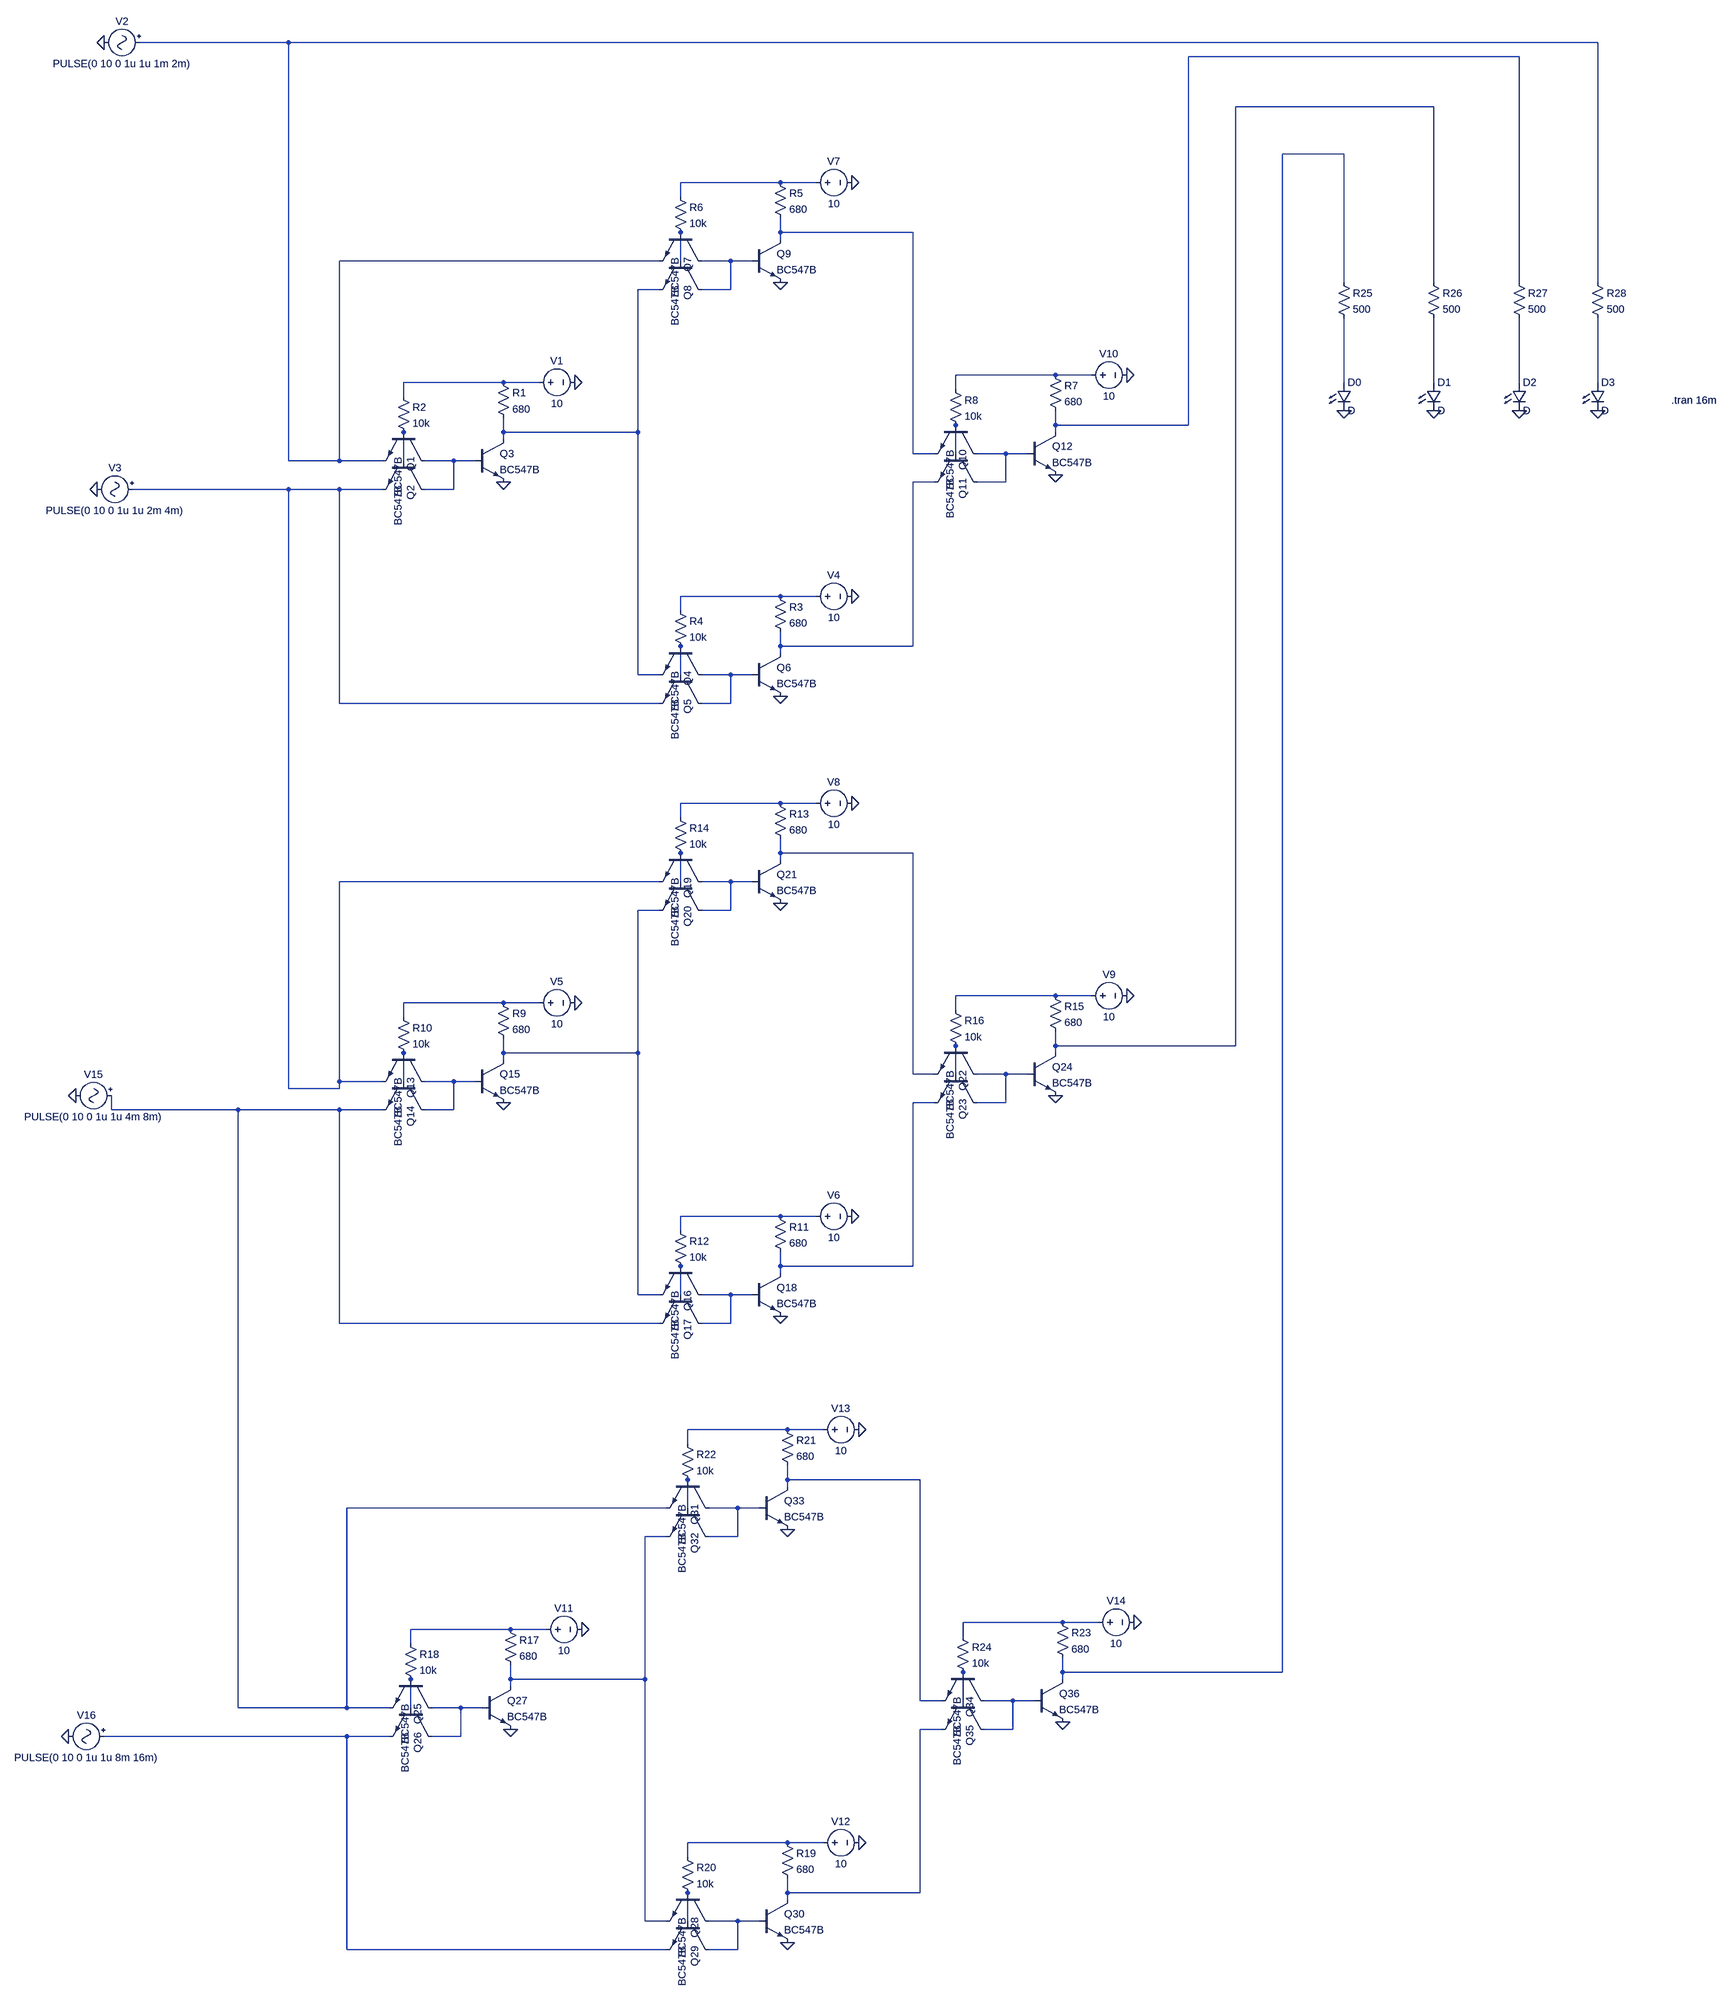
[diagram p0: schematic Draft1.asc]
Draft1.asc, the LTspice schematic file:
Version 4.1
SHEET 1 4320 3700
WIRE -544 -816 -2016 -816
WIRE 4000 -816 -544 -816
WIRE 3824 -784 1968 -784
WIRE 3632 -672 2144 -672
WIRE 3424 -544 2352 -544
WIRE 992 -480 768 -480
WIRE 1072 -480 992 -480
WIRE 768 -448 768 -480
WIRE 992 -368 992 -400
WIRE 1328 -368 992 -368
WIRE 992 -352 992 -368
WIRE 720 -304 -96 -304
WIRE 768 -304 768 -368
WIRE 880 -304 816 -304
WIRE 928 -304 880 -304
WIRE 3424 -256 3424 -544
WIRE 3632 -256 3632 -672
WIRE 3824 -256 3824 -784
WIRE 4000 -256 4000 -816
WIRE 720 -240 672 -240
WIRE 880 -240 880 -304
WIRE 880 -240 816 -240
WIRE 1648 -48 1424 -48
WIRE 1728 -48 1648 -48
WIRE 272 -32 48 -32
WIRE 352 -32 272 -32
WIRE 3424 -32 3424 -176
WIRE 3632 -32 3632 -176
WIRE 3824 -32 3824 -176
WIRE 4000 -32 4000 -176
WIRE 1424 -16 1424 -48
WIRE 48 0 48 -32
WIRE 1648 64 1648 32
WIRE 1968 64 1968 -784
WIRE 1968 64 1648 64
WIRE 272 80 272 48
WIRE 672 80 672 -240
WIRE 672 80 272 80
WIRE 1648 80 1648 64
WIRE 272 96 272 80
WIRE 1328 128 1328 -368
WIRE 1376 128 1328 128
WIRE 1424 128 1424 64
WIRE 1536 128 1472 128
WIRE 1584 128 1536 128
WIRE -544 144 -544 -816
WIRE -96 144 -96 -304
WIRE -96 144 -544 144
WIRE 0 144 -96 144
WIRE 48 144 48 80
WIRE 160 144 96 144
WIRE 208 144 160 144
WIRE 1376 192 1328 192
WIRE 1536 192 1536 128
WIRE 1536 192 1472 192
WIRE -544 208 -2032 208
WIRE -96 208 -544 208
WIRE 0 208 -96 208
WIRE 160 208 160 144
WIRE 160 208 96 208
WIRE 992 480 768 480
WIRE 1072 480 992 480
WIRE 768 512 768 480
WIRE 992 592 992 560
WIRE 1328 592 1328 192
WIRE 1328 592 992 592
WIRE 992 608 992 592
WIRE 672 656 672 80
WIRE 720 656 672 656
WIRE 768 656 768 592
WIRE 880 656 816 656
WIRE 928 656 880 656
WIRE -96 720 -96 208
WIRE 720 720 -96 720
WIRE 880 720 880 656
WIRE 880 720 816 720
WIRE 992 944 768 944
WIRE 1072 944 992 944
WIRE 768 976 768 944
WIRE 992 1056 992 1024
WIRE 1328 1056 992 1056
WIRE 992 1072 992 1056
WIRE 720 1120 -96 1120
WIRE 768 1120 768 1056
WIRE 880 1120 816 1120
WIRE 928 1120 880 1120
WIRE 720 1184 672 1184
WIRE 880 1184 880 1120
WIRE 880 1184 816 1184
WIRE 1648 1376 1424 1376
WIRE 1728 1376 1648 1376
WIRE 272 1392 48 1392
WIRE 352 1392 272 1392
WIRE 1424 1408 1424 1376
WIRE 48 1424 48 1392
WIRE 1648 1488 1648 1456
WIRE 2144 1488 2144 -672
WIRE 2144 1488 1648 1488
WIRE 272 1504 272 1472
WIRE 672 1504 672 1184
WIRE 672 1504 272 1504
WIRE 1648 1504 1648 1488
WIRE 272 1520 272 1504
WIRE 1328 1552 1328 1056
WIRE 1376 1552 1328 1552
WIRE 1424 1552 1424 1488
WIRE 1536 1552 1472 1552
WIRE 1584 1552 1536 1552
WIRE -96 1568 -96 1120
WIRE 0 1568 -96 1568
WIRE 48 1568 48 1504
WIRE 160 1568 96 1568
WIRE 208 1568 160 1568
WIRE -544 1584 -544 208
WIRE -96 1584 -96 1568
WIRE -96 1584 -544 1584
WIRE 1376 1616 1328 1616
WIRE 1536 1616 1536 1552
WIRE 1536 1616 1472 1616
WIRE -2080 1632 -2080 1600
WIRE -704 1632 -2080 1632
WIRE -96 1632 -704 1632
WIRE 0 1632 -96 1632
WIRE 160 1632 160 1568
WIRE 160 1632 96 1632
WIRE 992 1904 768 1904
WIRE 1072 1904 992 1904
WIRE 768 1936 768 1904
WIRE 992 2016 992 1984
WIRE 1328 2016 1328 1616
WIRE 1328 2016 992 2016
WIRE 992 2032 992 2016
WIRE 672 2080 672 1504
WIRE 720 2080 672 2080
WIRE 768 2080 768 2016
WIRE 880 2080 816 2080
WIRE 928 2080 880 2080
WIRE -96 2144 -96 1632
WIRE 720 2144 -96 2144
WIRE 880 2144 880 2080
WIRE 880 2144 816 2144
WIRE 1008 2416 784 2416
WIRE 1088 2416 1008 2416
WIRE 784 2448 784 2416
WIRE 1008 2528 1008 2496
WIRE 1344 2528 1008 2528
WIRE 1008 2544 1008 2528
WIRE 736 2592 -80 2592
WIRE 784 2592 784 2528
WIRE 896 2592 832 2592
WIRE 944 2592 896 2592
WIRE 736 2656 688 2656
WIRE 896 2656 896 2592
WIRE 896 2656 832 2656
WIRE 1664 2848 1440 2848
WIRE 1744 2848 1664 2848
WIRE 288 2864 64 2864
WIRE 368 2864 288 2864
WIRE 1440 2880 1440 2848
WIRE 64 2896 64 2864
WIRE 1664 2960 1664 2928
WIRE 2352 2960 2352 -544
WIRE 2352 2960 1664 2960
WIRE 288 2976 288 2944
WIRE 688 2976 688 2656
WIRE 688 2976 288 2976
WIRE 1664 2976 1664 2960
WIRE 288 2992 288 2976
WIRE 1344 3024 1344 2528
WIRE 1392 3024 1344 3024
WIRE 1440 3024 1440 2960
WIRE 1552 3024 1488 3024
WIRE 1600 3024 1552 3024
WIRE -704 3040 -704 1632
WIRE -80 3040 -80 2592
WIRE -80 3040 -704 3040
WIRE 16 3040 -80 3040
WIRE 64 3040 64 2976
WIRE 176 3040 112 3040
WIRE 224 3040 176 3040
WIRE 1392 3088 1344 3088
WIRE 1552 3088 1552 3024
WIRE 1552 3088 1488 3088
WIRE -80 3104 -2096 3104
WIRE 16 3104 -80 3104
WIRE 176 3104 176 3040
WIRE 176 3104 112 3104
WIRE 1008 3376 784 3376
WIRE 1088 3376 1008 3376
WIRE 784 3408 784 3376
WIRE 1008 3488 1008 3456
WIRE 1344 3488 1344 3088
WIRE 1344 3488 1008 3488
WIRE 1008 3504 1008 3488
WIRE 688 3552 688 2976
WIRE 736 3552 688 3552
WIRE 784 3552 784 3488
WIRE 896 3552 832 3552
WIRE 944 3552 896 3552
WIRE -80 3616 -80 3104
WIRE 736 3616 -80 3616
WIRE 896 3616 896 3552
WIRE 896 3616 832 3616
FLAG 272 192 0
FLAG 432 -32 0
FLAG 992 704 0
FLAG 1152 480 0
FLAG 992 -256 0
FLAG 1152 -480 0
FLAG 1648 176 0
FLAG 1808 -48 0
FLAG 272 1616 0
FLAG 432 1392 0
FLAG 992 2128 0
FLAG 1152 1904 0
FLAG 992 1168 0
FLAG 1152 944 0
FLAG 1648 1600 0
FLAG 1808 1376 0
FLAG 288 3088 0
FLAG 448 2864 0
FLAG 1008 3600 0
FLAG 1168 3376 0
FLAG 1008 2640 0
FLAG 1168 2416 0
FLAG 1664 3072 0
FLAG 1824 2848 0
FLAG -2096 -816 0
FLAG -2160 1600 0
FLAG -2176 3104 0
FLAG 4000 32 0
FLAG 3824 32 0
FLAG 3632 32 0
FLAG 3424 32 0
FLAG -2112 208 0
SYMBOL npn 96 80 R90
WINDOW 3 56 60 Left 2
SYMATTR InstName Q1
SYMATTR Value BC547B
SYMBOL npn 96 144 R90
WINDOW 3 56 60 Left 2
SYMATTR InstName Q2
SYMATTR Value BC547B
SYMBOL npn 208 96 R0
SYMATTR InstName Q3
SYMATTR Value BC547B
SYMBOL res 256 -48 R0
SYMATTR InstName R1
SYMATTR Value 680
SYMBOL res 32 -16 R0
SYMATTR InstName R2
SYMATTR Value 10k
SYMBOL voltage 336 -32 R270
WINDOW 0 32 56 VTop 2
WINDOW 3 -32 56 VBottom 2
WINDOW 123 0 0 Left 0
WINDOW 39 0 0 Left 0
SYMATTR InstName V1
SYMATTR Value 10
SYMBOL npn 816 592 R90
WINDOW 3 56 60 Left 2
SYMATTR InstName Q4
SYMATTR Value BC547B
SYMBOL npn 816 656 R90
WINDOW 3 56 60 Left 2
SYMATTR InstName Q5
SYMATTR Value BC547B
SYMBOL npn 928 608 R0
SYMATTR InstName Q6
SYMATTR Value BC547B
SYMBOL res 976 464 R0
SYMATTR InstName R3
SYMATTR Value 680
SYMBOL res 752 496 R0
SYMATTR InstName R4
SYMATTR Value 10k
SYMBOL voltage 1056 480 R270
WINDOW 0 32 56 VTop 2
WINDOW 3 -32 56 VBottom 2
WINDOW 123 0 0 Left 0
WINDOW 39 0 0 Left 0
SYMATTR InstName V4
SYMATTR Value 10
SYMBOL npn 816 -368 R90
WINDOW 3 56 60 Left 2
SYMATTR InstName Q7
SYMATTR Value BC547B
SYMBOL npn 816 -304 R90
WINDOW 3 56 60 Left 2
SYMATTR InstName Q8
SYMATTR Value BC547B
SYMBOL npn 928 -352 R0
SYMATTR InstName Q9
SYMATTR Value BC547B
SYMBOL res 976 -496 R0
SYMATTR InstName R5
SYMATTR Value 680
SYMBOL res 752 -464 R0
SYMATTR InstName R6
SYMATTR Value 10k
SYMBOL voltage 1056 -480 R270
WINDOW 0 32 56 VTop 2
WINDOW 3 -32 56 VBottom 2
WINDOW 123 0 0 Left 0
WINDOW 39 0 0 Left 0
SYMATTR InstName V7
SYMATTR Value 10
SYMBOL npn 1472 64 R90
WINDOW 3 56 60 Left 2
SYMATTR InstName Q10
SYMATTR Value BC547B
SYMBOL npn 1472 128 R90
WINDOW 3 56 60 Left 2
SYMATTR InstName Q11
SYMATTR Value BC547B
SYMBOL npn 1584 80 R0
SYMATTR InstName Q12
SYMATTR Value BC547B
SYMBOL res 1632 -64 R0
SYMATTR InstName R7
SYMATTR Value 680
SYMBOL res 1408 -32 R0
SYMATTR InstName R8
SYMATTR Value 10k
SYMBOL voltage 1712 -48 R270
WINDOW 0 32 56 VTop 2
WINDOW 3 -32 56 VBottom 2
WINDOW 123 0 0 Left 0
WINDOW 39 0 0 Left 0
SYMATTR InstName V10
SYMATTR Value 10
SYMBOL npn 96 1504 R90
WINDOW 3 56 60 Left 2
SYMATTR InstName Q13
SYMATTR Value BC547B
SYMBOL npn 96 1568 R90
WINDOW 3 56 60 Left 2
SYMATTR InstName Q14
SYMATTR Value BC547B
SYMBOL npn 208 1520 R0
SYMATTR InstName Q15
SYMATTR Value BC547B
SYMBOL res 256 1376 R0
SYMATTR InstName R9
SYMATTR Value 680
SYMBOL res 32 1408 R0
SYMATTR InstName R10
SYMATTR Value 10k
SYMBOL voltage 336 1392 R270
WINDOW 0 32 56 VTop 2
WINDOW 3 -32 56 VBottom 2
WINDOW 123 0 0 Left 0
WINDOW 39 0 0 Left 0
SYMATTR InstName V5
SYMATTR Value 10
SYMBOL npn 816 2016 R90
WINDOW 3 56 60 Left 2
SYMATTR InstName Q16
SYMATTR Value BC547B
SYMBOL npn 816 2080 R90
WINDOW 3 56 60 Left 2
SYMATTR InstName Q17
SYMATTR Value BC547B
SYMBOL npn 928 2032 R0
SYMATTR InstName Q18
SYMATTR Value BC547B
SYMBOL res 976 1888 R0
SYMATTR InstName R11
SYMATTR Value 680
SYMBOL res 752 1920 R0
SYMATTR InstName R12
SYMATTR Value 10k
SYMBOL voltage 1056 1904 R270
WINDOW 0 32 56 VTop 2
WINDOW 3 -32 56 VBottom 2
WINDOW 123 0 0 Left 0
WINDOW 39 0 0 Left 0
SYMATTR InstName V6
SYMATTR Value 10
SYMBOL npn 816 1056 R90
WINDOW 3 56 60 Left 2
SYMATTR InstName Q19
SYMATTR Value BC547B
SYMBOL npn 816 1120 R90
WINDOW 3 56 60 Left 2
SYMATTR InstName Q20
SYMATTR Value BC547B
SYMBOL npn 928 1072 R0
SYMATTR InstName Q21
SYMATTR Value BC547B
SYMBOL res 976 928 R0
SYMATTR InstName R13
SYMATTR Value 680
SYMBOL res 752 960 R0
SYMATTR InstName R14
SYMATTR Value 10k
SYMBOL voltage 1056 944 R270
WINDOW 0 32 56 VTop 2
WINDOW 3 -32 56 VBottom 2
WINDOW 123 0 0 Left 0
WINDOW 39 0 0 Left 0
SYMATTR InstName V8
SYMATTR Value 10
SYMBOL npn 1472 1488 R90
WINDOW 3 56 60 Left 2
SYMATTR InstName Q22
SYMATTR Value BC547B
SYMBOL npn 1472 1552 R90
WINDOW 3 56 60 Left 2
SYMATTR InstName Q23
SYMATTR Value BC547B
SYMBOL npn 1584 1504 R0
SYMATTR InstName Q24
SYMATTR Value BC547B
SYMBOL res 1632 1360 R0
SYMATTR InstName R15
SYMATTR Value 680
SYMBOL res 1408 1392 R0
SYMATTR InstName R16
SYMATTR Value 10k
SYMBOL voltage 1712 1376 R270
WINDOW 0 32 56 VTop 2
WINDOW 3 -32 56 VBottom 2
WINDOW 123 0 0 Left 0
WINDOW 39 0 0 Left 0
SYMATTR InstName V9
SYMATTR Value 10
SYMBOL npn 112 2976 R90
WINDOW 3 56 60 Left 2
SYMATTR InstName Q25
SYMATTR Value BC547B
SYMBOL npn 112 3040 R90
WINDOW 3 56 60 Left 2
SYMATTR InstName Q26
SYMATTR Value BC547B
SYMBOL npn 224 2992 R0
SYMATTR InstName Q27
SYMATTR Value BC547B
SYMBOL res 272 2848 R0
SYMATTR InstName R17
SYMATTR Value 680
SYMBOL res 48 2880 R0
SYMATTR InstName R18
SYMATTR Value 10k
SYMBOL voltage 352 2864 R270
WINDOW 0 32 56 VTop 2
WINDOW 3 -32 56 VBottom 2
WINDOW 123 0 0 Left 0
WINDOW 39 0 0 Left 0
SYMATTR InstName V11
SYMATTR Value 10
SYMBOL npn 832 3488 R90
WINDOW 3 56 60 Left 2
SYMATTR InstName Q28
SYMATTR Value BC547B
SYMBOL npn 832 3552 R90
WINDOW 3 56 60 Left 2
SYMATTR InstName Q29
SYMATTR Value BC547B
SYMBOL npn 944 3504 R0
SYMATTR InstName Q30
SYMATTR Value BC547B
SYMBOL res 992 3360 R0
SYMATTR InstName R19
SYMATTR Value 680
SYMBOL res 768 3392 R0
SYMATTR InstName R20
SYMATTR Value 10k
SYMBOL voltage 1072 3376 R270
WINDOW 0 32 56 VTop 2
WINDOW 3 -32 56 VBottom 2
WINDOW 123 0 0 Left 0
WINDOW 39 0 0 Left 0
SYMATTR InstName V12
SYMATTR Value 10
SYMBOL npn 832 2528 R90
WINDOW 3 56 60 Left 2
SYMATTR InstName Q31
SYMATTR Value BC547B
SYMBOL npn 832 2592 R90
WINDOW 3 56 60 Left 2
SYMATTR InstName Q32
SYMATTR Value BC547B
SYMBOL npn 944 2544 R0
SYMATTR InstName Q33
SYMATTR Value BC547B
SYMBOL res 992 2400 R0
SYMATTR InstName R21
SYMATTR Value 680
SYMBOL res 768 2432 R0
SYMATTR InstName R22
SYMATTR Value 10k
SYMBOL voltage 1072 2416 R270
WINDOW 0 32 56 VTop 2
WINDOW 3 -32 56 VBottom 2
WINDOW 123 0 0 Left 0
WINDOW 39 0 0 Left 0
SYMATTR InstName V13
SYMATTR Value 10
SYMBOL npn 1488 2960 R90
WINDOW 3 56 60 Left 2
SYMATTR InstName Q34
SYMATTR Value BC547B
SYMBOL npn 1488 3024 R90
WINDOW 3 56 60 Left 2
SYMATTR InstName Q35
SYMATTR Value BC547B
SYMBOL npn 1600 2976 R0
SYMATTR InstName Q36
SYMATTR Value BC547B
SYMBOL res 1648 2832 R0
SYMATTR InstName R23
SYMATTR Value 680
SYMBOL res 1424 2864 R0
SYMATTR InstName R24
SYMATTR Value 10k
SYMBOL voltage 1728 2848 R270
WINDOW 0 32 56 VTop 2
WINDOW 3 -32 56 VBottom 2
WINDOW 123 0 0 Left 0
WINDOW 39 0 0 Left 0
SYMATTR InstName V14
SYMATTR Value 10
SYMBOL Misc\\signal -2000 -816 R90
WINDOW 0 -32 56 VBottom 2
WINDOW 3 32 56 VTop 2
WINDOW 123 0 0 Left 0
WINDOW 39 0 0 Left 0
SYMATTR InstName V2
SYMATTR Value PULSE(0 10 0 1u 1u 1m 2m)
SYMBOL Misc\\signal -2016 208 R90
WINDOW 0 -32 56 VBottom 2
WINDOW 3 32 56 VTop 2
WINDOW 123 0 0 Left 0
WINDOW 39 0 0 Left 0
SYMATTR InstName V3
SYMATTR Value PULSE(0 10 0 1u 1u 2m 4m)
SYMBOL Misc\\signal -2064 1600 R90
WINDOW 0 -32 56 VBottom 2
WINDOW 3 32 56 VTop 2
WINDOW 123 0 0 Left 0
WINDOW 39 0 0 Left 0
SYMATTR InstName V15
SYMATTR Value PULSE(0 10 0 1u 1u 4m 8m)
SYMBOL Misc\\signal -2080 3104 R90
WINDOW 0 -32 56 VBottom 2
WINDOW 3 32 56 VTop 2
WINDOW 123 0 0 Left 0
WINDOW 39 0 0 Left 0
SYMATTR InstName V16
SYMATTR Value PULSE(0 10 0 1u 1u 8m 16m)
SYMBOL LED 3408 -32 R0
SYMATTR InstName D0
SYMBOL LED 3616 -32 R0
SYMATTR InstName D1
SYMBOL LED 3984 -32 R0
SYMATTR InstName D3
SYMBOL LED 3808 -32 R0
SYMATTR InstName D2
SYMBOL res 3408 -272 R0
SYMATTR InstName R25
SYMATTR Value 500
SYMBOL res 3616 -272 R0
SYMATTR InstName R26
SYMATTR Value 500
SYMBOL res 3808 -272 R0
SYMATTR InstName R27
SYMATTR Value 500
SYMBOL res 3984 -272 R0
SYMATTR InstName R28
SYMATTR Value 500
TEXT 4200 8 Left 2 !.tran 16m

The netlist it stands for:
* Draft1.asc
Q1 N019 N018 N001 0 BC547B
Q2 N019 N018 N021 0 BC547B
Q3 N009 N019 0 0 BC547B
R1 N011 N009 680
R2 N011 N018 10k
V1 N011 0 10
Q4 N024 N023 N009 0 BC547B
Q5 N024 N023 N021 0 BC547B
Q6 N020 N024 0 0 BC547B
R3 N022 N020 680
R4 N022 N023 10k
V4 N022 0 10
Q7 N008 N007 N001 0 BC547B
Q8 N008 N007 N009 0 BC547B
Q9 N006 N008 0 0 BC547B
R5 N005 N006 680
R6 N005 N007 10k
V7 N005 0 10
Q10 N017 N016 N006 0 BC547B
Q11 N017 N016 N020 0 BC547B
Q12 N002 N017 0 0 BC547B
R7 N010 N002 680
R8 N010 N016 10k
V10 N010 0 10
Q13 N035 N034 N021 0 BC547B
Q14 N035 N034 N037 0 BC547B
Q15 N029 N035 0 0 BC547B
R9 N031 N029 680
R10 N031 N034 10k
V5 N031 0 10
Q16 N040 N039 N029 0 BC547B
Q17 N040 N039 N037 0 BC547B
Q18 N036 N040 0 0 BC547B
R11 N038 N036 680
R12 N038 N039 10k
V6 N038 0 10
Q19 N028 N027 N021 0 BC547B
Q20 N028 N027 N029 0 BC547B
Q21 N026 N028 0 0 BC547B
R13 N025 N026 680
R14 N025 N027 10k
V8 N025 0 10
Q22 N033 N032 N026 0 BC547B
Q23 N033 N032 N036 0 BC547B
Q24 N003 N033 0 0 BC547B
R15 N030 N003 680
R16 N030 N032 10k
V9 N030 0 10
Q25 N051 N050 N037 0 BC547B
Q26 N051 N050 N053 0 BC547B
Q27 N045 N051 0 0 BC547B
R17 N047 N045 680
R18 N047 N050 10k
V11 N047 0 10
Q28 N056 N055 N045 0 BC547B
Q29 N056 N055 N053 0 BC547B
Q30 N052 N056 0 0 BC547B
R19 N054 N052 680
R20 N054 N055 10k
V12 N054 0 10
Q31 N044 N043 N037 0 BC547B
Q32 N044 N043 N045 0 BC547B
Q33 N042 N044 0 0 BC547B
R21 N041 N042 680
R22 N041 N043 10k
V13 N041 0 10
Q34 N049 N048 N042 0 BC547B
Q35 N049 N048 N052 0 BC547B
Q36 N004 N049 0 0 BC547B
R23 N046 N004 680
R24 N046 N048 10k
V14 N046 0 10
V2 N001 0 PULSE(0 10 0 1u 1u 1m 2m)
V3 N021 0 PULSE(0 10 0 1u 1u 2m 4m)
V15 N037 0 PULSE(0 10 0 1u 1u 4m 8m)
V16 N053 0 PULSE(0 10 0 1u 1u 8m 16m)
D0 N012 0 D
D1 N013 0 D
D3 N015 0 D
D2 N014 0 D
R25 N004 N012 500
R26 N003 N013 500
R27 N002 N014 500
R28 N001 N015 500
.model D D
.lib standard.dio
.model NPN NPN
.model PNP PNP
.lib standard.bjt
.tran 16m
.backanno
.end